# Altium schematic sheet Salmon.SchDoc: Top Sheet
size A3; SheetNumber: 1; SheetTotal: 6; DocumentName: Top Sheet
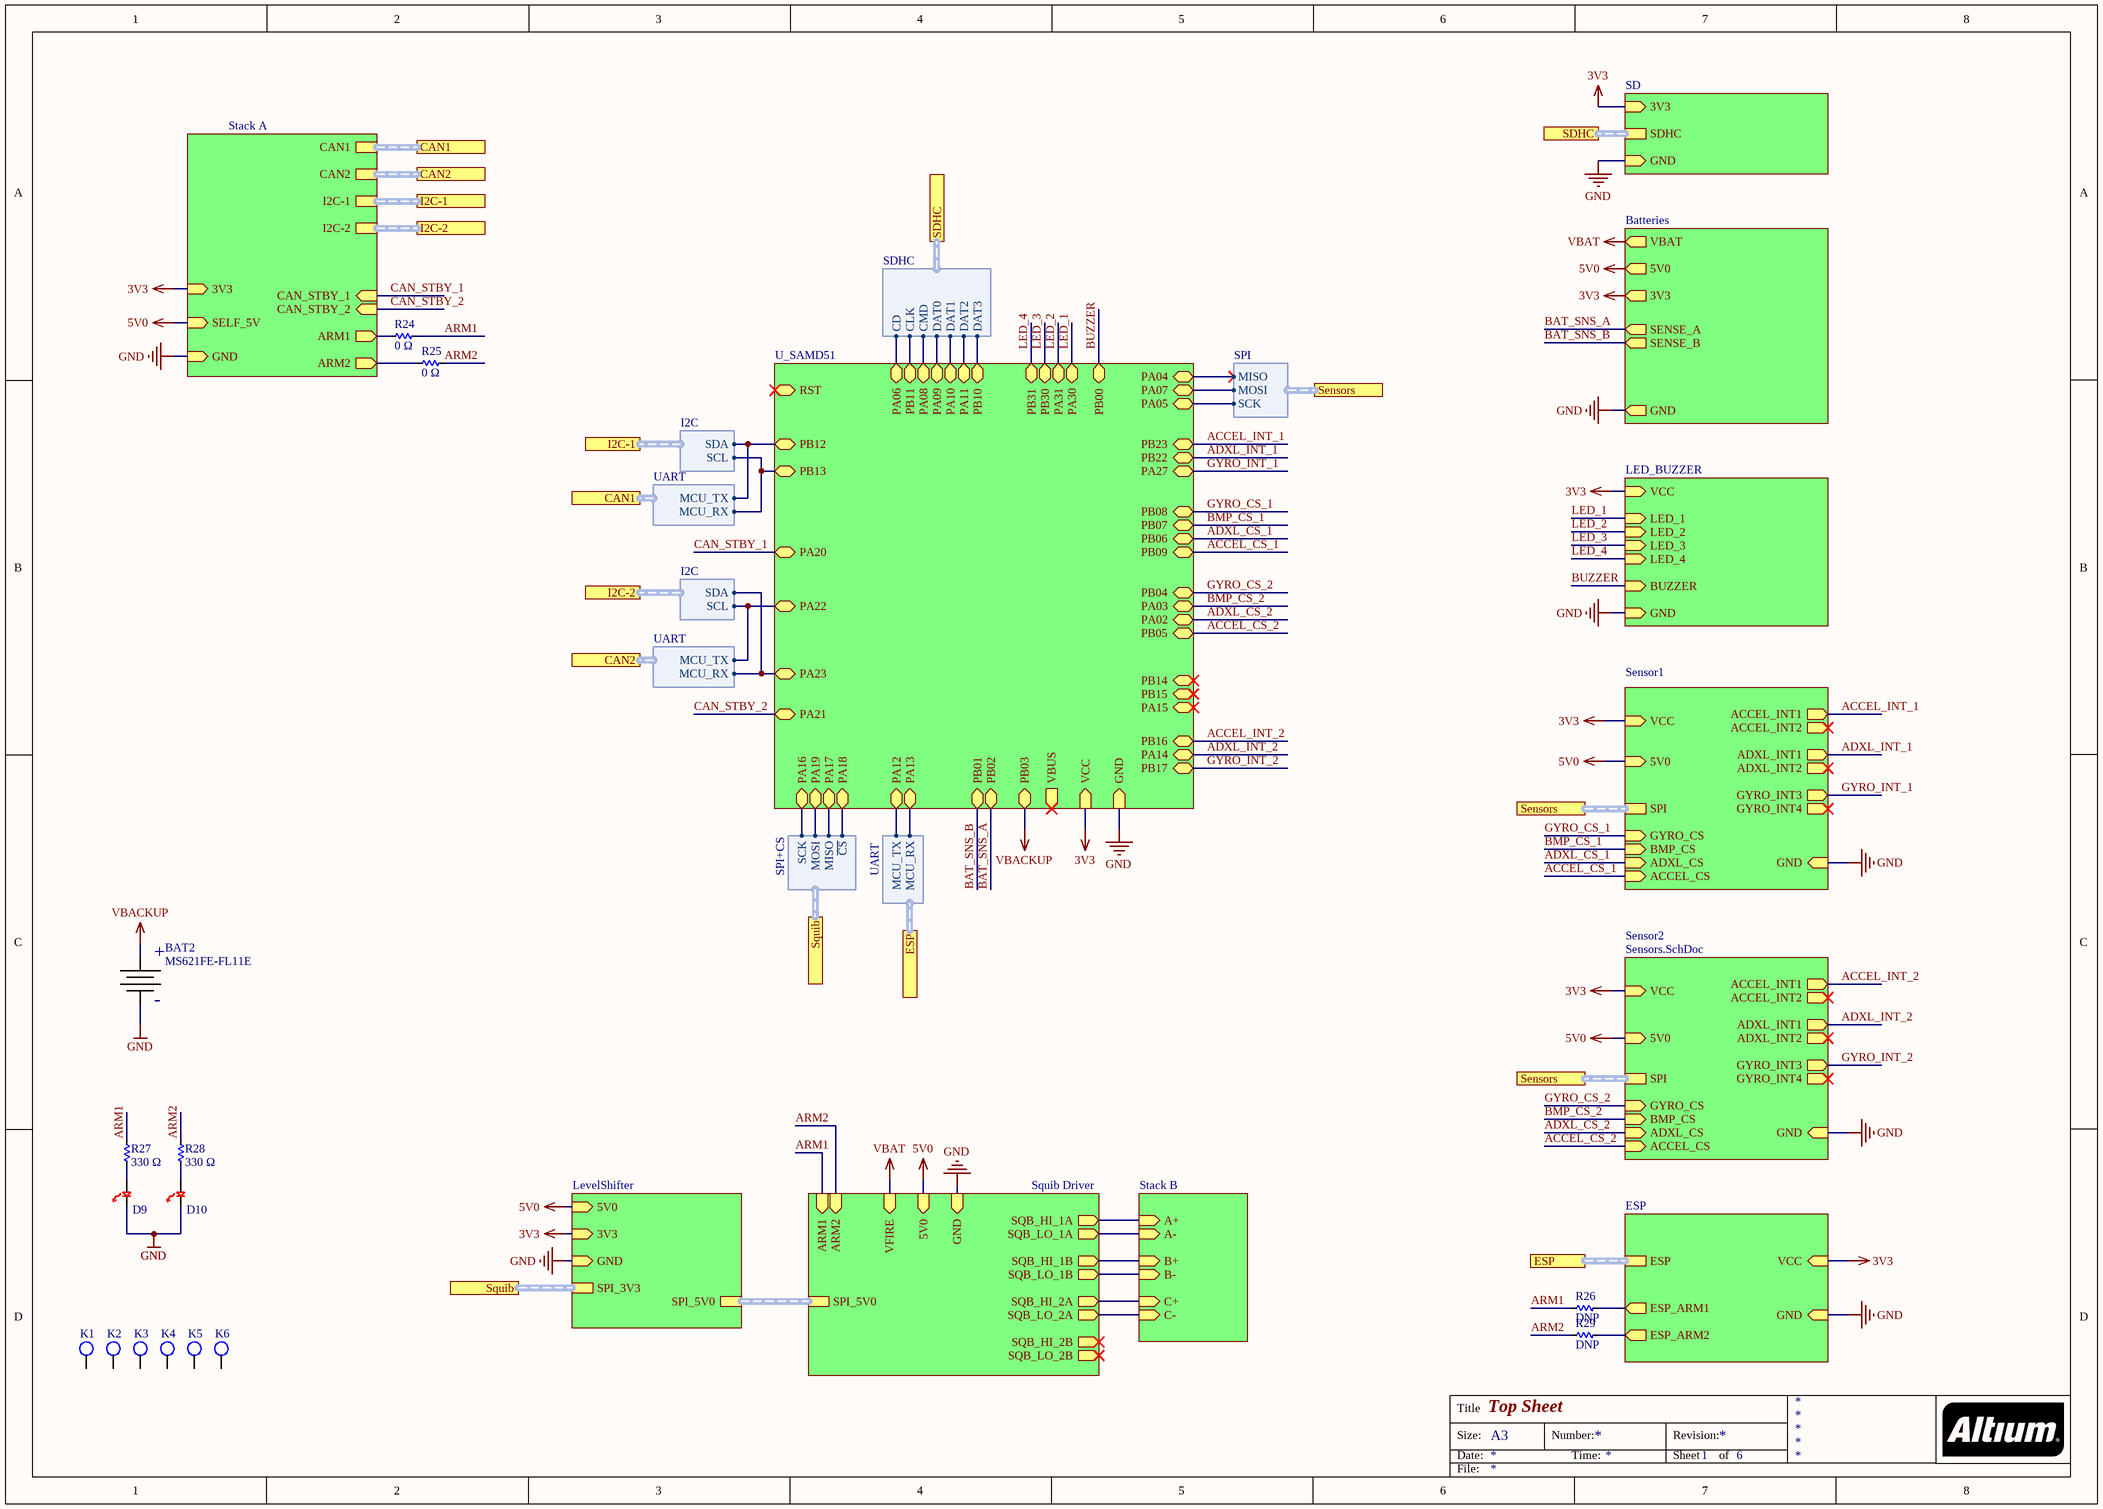
[diagram p0: Salmon.SchDoc]

## Parts
BAT2  MS621FE-FL11E  [BATT_COINCELL_RECHARGEABLE]
D9  RED  [0805_Diode]  (value not drawn)
D10  RED  [0805_Diode]  (value not drawn)
K1  92985A610  [#4_PRESSFIT_FOOT_1/4]  (value not drawn)
K2  92985A610  [#4_PRESSFIT_FOOT_1/4]  (value not drawn)
K3  92985A610  [#4_PRESSFIT_FOOT_1/4]  (value not drawn)
K4  92985A610  [#4_PRESSFIT_FOOT_1/4]  (value not drawn)
K5  92985A610  [#4_PRESSFIT_FOOT_1/4]  (value not drawn)
K6  92985A610  [#4_PRESSFIT_FOOT_1/4]  (value not drawn)
R24  Resistance: 0 Ω  [R0603]  (hidden comment: __template_resistor)
R25  Resistance: 0 Ω  [R0603]  (hidden comment: __template_resistor)
R26  Resistance: DNP  [R0603]  (hidden comment: __template_resistor)
R27  Resistance: 330 Ω  [R0603]  (hidden comment: __template_resistor)
R28  Resistance: 330 Ω  [R0603]  (hidden comment: __template_resistor)
R29  Resistance: DNP  [R0603]  (hidden comment: __template_resistor)

## Sub-sheets
Batteries = Battery_Management: SENSE_A (out), SENSE_B (out), 5V0 (out), GND (out), 3V3 (out), VBAT (out)
ESP = ESP8266.SchDoc: ESP_ARM2 (out), ESP_ARM1 (out), VCC (in), GND (in), ESP (harness UART)
LED_BUZZER = Blink_Blink_Beep_Boop: LED_1 (in), LED_2 (in), LED_3 (in), LED_4 (in), BUZZER (in), GND (in), VCC (in)
LevelShifter = LevelShifter.SchDoc: SPI_3V3 (harness SPI+CS), SPI_5V0 (harness SPI+CS), 5V0 (in), 3V3 (in), GND (in)
SD = SD.SchDoc: SDHC (harness SDHC), GND (in), 3V3 (in)
Sensor1 = Sensors.SchDoc: SPI (harness SPI), GYRO_CS (in), BMP_CS (in), ADXL_CS (in), ACCEL_CS (in), ACCEL_INT1 (out), ACCEL_INT2 (out), ADXL_INT1 (out), ADXL_INT2 (out), GYRO_INT3 (out), GYRO_INT4 (out), GND (in), VCC (in), 5V0 (in)
Sensor2 = Sensors.SchDoc: SPI (harness SPI), GYRO_CS (in), BMP_CS (in), ADXL_CS (in), ACCEL_CS (in), ACCEL_INT1 (out), ACCEL_INT2 (out), ADXL_INT1 (out), ADXL_INT2 (out), GYRO_INT3 (out), GYRO_INT4 (out), GND (in), VCC (in), 5V0 (in)
Squib Driver = MC33797.SchDoc: SPI_5V0 (harness SPI+CS), SQB_LO_1A (out), SQB_HI_1A (out), SQB_LO_1B (out), SQB_HI_1B (out), SQB_HI_2A (out), SQB_LO_2A (out), ARM1 (in), ARM2 (in), 5V0 (in), VFIRE (in), GND (in), SQB_HI_2B (out), SQB_LO_2B (out)
Stack A = Stack_A.SchDoc: CAN2 (harness UART), I2C-2 (harness I2C), I2C-1 (harness I2C), CAN1 (harness UART), CAN_STBY_2 (in), CAN_STBY_1 (in), ARM1 (out), ARM2 (out), GND (in), SELF_5V (in), 3V3 (in)
Stack B = Stack_B.SchDoc: B- (in), C+ (in), B+ (in), A- (in), A+ (in), C- (in)
U_SAMD51 = SAMD51.SchDoc: PA12 (bidir), PA13 (bidir), PA05 (bidir), PA07 (bidir), PA04 (bidir), PA06 (bidir), PB11 (bidir), PA08 (bidir), PA09 (bidir), PA10 (bidir), PA11 (bidir), PB10 (bidir), PB12 (bidir), PB13 (bidir), PA22 (bidir), PA23 (bidir), PA16 (bidir), PA19 (bidir), PA17 (bidir), PA20 (bidir), PA21 (bidir), PB08 (bidir), PB07 (bidir), PB06 (bidir), PB09 (bidir), PB04 (bidir), PA03 (bidir), PA02 (bidir), PB05 (bidir), PB00 (bidir), PB30 (bidir), PA31 (bidir), PA30 (bidir), PB31 (bidir), PB16 (bidir), PA14 (bidir), PB17 (bidir), PB23 (bidir), PB22 (bidir), PA27 (bidir), PB02 (bidir), PB01 (bidir), PB03 (bidir), PA18 (bidir), GND (in), VCC (in), VBUS (out), PB14 (bidir), PB15 (bidir), PA15 (bidir), RST (bidir)

## Ports
CAN1 (harness UART), CAN2 (harness UART), ESP (harness UART), I2C-1 (harness I2C), I2C-2 (harness I2C), SDHC, SDHC (harness SDHC), Sensors (harness SPI), Squib (harness SPI+CS)

## Harnesses
UART: MCU_TX, MCU_RX
SPI: MISO, MOSI, SCK
SDHC: CD, CLK, CMD, DAT0, DAT1, DAT2, DAT3
I2C: SCL, SDA
UART: MCU_RX, MCU_TX
SPI+CS: MISO, MOSI, SCK, ~{CS}

## Nets
3V3: sheet Sensor1/VCC, sheet Batteries/3V3, sheet LED_BUZZER/VCC, sheet ESP/VCC, sheet U_SAMD51/VCC, sheet Sensor2/VCC, sheet Stack A/3V3, sheet LevelShifter/3V3, sheet SD/3V3
5V0: sheet Sensor1/5V0, sheet Batteries/5V0, sheet Sensor2/5V0, sheet Stack A/SELF_5V, sheet Squib Driver/5V0, sheet LevelShifter/5V0
GND: BAT2.- D9.1 D10.1 ; sheet Sensor1/GND, sheet Batteries/GND, sheet LED_BUZZER/GND, sheet ESP/GND, sheet U_SAMD51/GND, sheet Sensor2/GND, sheet Stack A/GND, sheet Squib Driver/GND, sheet LevelShifter/GND, sheet SD/GND
VBACKUP: BAT2.+ ; sheet U_SAMD51/PB03
VBAT: sheet Batteries/VBAT, sheet Squib Driver/VFIRE
ACCEL_CS_1: sheet Sensor1/ACCEL_CS, sheet U_SAMD51/PB09
ACCEL_CS_2: sheet U_SAMD51/PB05, sheet Sensor2/ACCEL_CS
ACCEL_INT_1: sheet Sensor1/ACCEL_INT1, sheet U_SAMD51/PB23
ACCEL_INT_2: sheet U_SAMD51/PB16, sheet Sensor2/ACCEL_INT1
ADXL_CS_1: sheet Sensor1/ADXL_CS, sheet U_SAMD51/PB06
ADXL_CS_2: sheet U_SAMD51/PA02, sheet Sensor2/ADXL_CS
ADXL_INT_1: sheet Sensor1/ADXL_INT1, sheet U_SAMD51/PB22
ADXL_INT_2: sheet U_SAMD51/PA14, sheet Sensor2/ADXL_INT1
ARM1: R24.2 R26.1 R27.2 ; sheet Squib Driver/ARM1
ARM2: R25.2 R28.2 R29.1 ; sheet Squib Driver/ARM2
BAT_SNS_A: sheet Batteries/SENSE_A, sheet U_SAMD51/PB02
BAT_SNS_B: sheet Batteries/SENSE_B, sheet U_SAMD51/PB01
BMP_CS_1: sheet Sensor1/BMP_CS, sheet U_SAMD51/PB07
BMP_CS_2: sheet U_SAMD51/PA03, sheet Sensor2/BMP_CS
BUZZER: sheet LED_BUZZER/BUZZER, sheet U_SAMD51/PB00
CAN_STBY_1: sheet U_SAMD51/PA20, sheet Stack A/CAN_STBY_1
CAN_STBY_2: sheet U_SAMD51/PA21, sheet Stack A/CAN_STBY_2
GYRO_CS_1: sheet Sensor1/GYRO_CS, sheet U_SAMD51/PB08
GYRO_CS_2: sheet U_SAMD51/PB04, sheet Sensor2/GYRO_CS
GYRO_INT_1: sheet Sensor1/GYRO_INT3, sheet U_SAMD51/PA27
GYRO_INT_2: sheet U_SAMD51/PB17, sheet Sensor2/GYRO_INT3
LED_1: sheet LED_BUZZER/LED_1, sheet U_SAMD51/PA30
LED_2: sheet LED_BUZZER/LED_2, sheet U_SAMD51/PA31
LED_3: sheet LED_BUZZER/LED_3, sheet U_SAMD51/PB30
LED_4: sheet LED_BUZZER/LED_4, sheet U_SAMD51/PB31
NetD9_2: D9.2 R27.1
NetD10_2: D10.2 R28.1
NetR24_1: R24.1 ; sheet Stack A/ARM1
NetR25_1: R25.1 ; sheet Stack A/ARM2
NetR26_2: R26.2 ; sheet ESP/ESP_ARM1
NetR29_2: R29.2 ; sheet ESP/ESP_ARM2
(unnamed): sheet U_SAMD51/PA12, port ESP.MCU_TX
(unnamed): sheet U_SAMD51/PA13, port ESP.MCU_RX
(unnamed): sheet U_SAMD51/PA05, port Sensors.SCK
(unnamed): sheet U_SAMD51/PA07, port Sensors.MOSI
(unnamed): sheet U_SAMD51/PA04, port Sensors.MISO
(unnamed): sheet U_SAMD51/PA06, port SDHC.CD
(unnamed): sheet U_SAMD51/PB11, port SDHC.CLK
(unnamed): sheet U_SAMD51/PA08, port SDHC.CMD
(unnamed): sheet U_SAMD51/PA09, port SDHC.DAT0
(unnamed): sheet U_SAMD51/PA10, port SDHC.DAT1
(unnamed): sheet U_SAMD51/PA11, port SDHC.DAT2
(unnamed): sheet U_SAMD51/PB10, port SDHC.DAT3
(unnamed): sheet U_SAMD51/PB12, port I2C-1.SDA, port CAN1.MCU_TX
(unnamed): sheet U_SAMD51/PB13, port I2C-1.SCL, port CAN1.MCU_RX
(unnamed): sheet U_SAMD51/PA22, port I2C-2.SCL, port CAN2.MCU_TX
(unnamed): sheet U_SAMD51/PA23, port I2C-2.SDA, port CAN2.MCU_RX
(unnamed): sheet U_SAMD51/PA16, port Squib.SCK
(unnamed): sheet U_SAMD51/PA19, port Squib.MOSI
(unnamed): sheet U_SAMD51/PA17, port Squib.MISO
(unnamed): sheet U_SAMD51/PA18, port Squib.~{CS}
(unnamed): sheet Stack B/B-, sheet Squib Driver/SQB_LO_1B
(unnamed): sheet Stack B/C+, sheet Squib Driver/SQB_HI_2A
(unnamed): sheet Stack B/B+, sheet Squib Driver/SQB_HI_1B
(unnamed): sheet Stack B/A-, sheet Squib Driver/SQB_LO_1A
(unnamed): sheet Stack B/A+, sheet Squib Driver/SQB_HI_1A
(unnamed): sheet Stack B/C-, sheet Squib Driver/SQB_LO_2A

Not connected (* = marked no-connect by the designer): K1 1; K2 1; K3 1; K4 1; K5 1; K6 1

## Buses and harness runs
harness port CAN1 = sheet Stack A/CAN1
harness port CAN2 = sheet Stack A/CAN2
harness port ESP = sheet ESP/ESP
harness port I2C-1 = sheet Stack A/I2C-1
harness port I2C-2 = sheet Stack A/I2C-2
harness port SDHC = sheet SD/SDHC
harness port Sensors = sheet Sensor1/SPI
harness port Sensors = sheet Sensor2/SPI
harness port Squib = sheet LevelShifter/SPI_3V3
harness sheet LevelShifter/SPI_5V0 = sheet Squib Driver/SPI_5V0

## Notes on the sheet
- Title
- Size:
- Date:
- A3
- Number:
- Time:
- Revision:
- Sheet
- of
- File:

## Library data of the parts
BAT2 = BAT_MS621FE: MS621FE RECHARGEABLE COIN CELL BACKUP; Manufacturer: Seiko Instruments; Battery Chemistry: Lithium; Battery Cell Size: Coin, 6.8mm; Capacity: 5.5mAh; Discharge Rate: 15µA; Shipping Info: Due to restrictions, only ground shipment is allowed.; Supplier 1: Digi-Key; Manufacturer Part Number: MS621FE-FL11E; RoHS: RoHS Compliant; Category: Battery Products; Stock 1: 41059; Pricing 1: 1=2.04, 10=1.838, 50=1.6338, 100=1.4296, 250=1.30704, 500=1.22534, 1000=1.09051, 2500=1.0112, 5000=0.99138 (USD); Part Status: Active; Size / Dimension: 0.27" Dia x 0.08" H (6.8mm x 2.1mm); Termination Style: SMD (SMT) Tab; Standard Charge Current: 15µA; Standard Charge Time: -; Weight: 0.23g; ComponentLink1URL: http://www.sii.co.jp/en/me/files/2017/04/MicroBatteryCatalogue-E_2017_web.pdf; ComponentLink1Description: http://www.sii.co.jp/en/me/files/2017/04/MicroBatteryCatalogue-E_2017_web.pdf; Supplier Part Number 1: 728-1057-ND
D9 D10 = LED_LY974: LED 0805 RED 20MA; Manufacturer: OSRAM Opto Semiconductors Inc; Manufacturer Part Number: LH R974-LP-1; Wavelength - Dominant: 645nm; Wavelength - Peak: 660nm; Millicandela Rating: 41mcd; Voltage - Forward (Vf) (Typ): 1.8V; Viewing Angle: 160°; Lens Transparency: Diffused; Lens Color: White; Lens Style/Size: Rectangle with Flat Top, 1.30mm x 1.25mm; Supplier 1: Digi-Key; RoHS: RoHS Compliant; Category: Optoelectronics; Stock 1: 66379; Pricing 1: 1=0.08, 10=0.07, 100=0.0559, 250=0.04892, 500=0.04472 (USD); Packaging: Cut Tape (CT); Color: Red; Package / Case: 0805 (2012 Metric); Supplier Device Package: *; Size / Dimension: 2.00mm L x 1.25mm W; Height (Max): 0.80mm; Mounting Type: Surface Mount; ComponentLink1URL: http://www.osram-os.com/Graphics/XPic8/00078869_0.pdf; ComponentLink1Description: http://www.osram-os.com/Graphics/XPic8/00078869_0.pdf; Supplier Part Number 1: 475-1415-1-ND; Current - Test: 20mA
K1-K6 = #4_PRESSFIT_MOUNTING_FOOT: Press-Fit Unthreaded Spacers, 7/32" OD, 1/8" Long; Supplier Link: https://www.mcmaster.com/#92985a610/=16cb2ec
R24 R25 = RES SMD 0 OHM JUMPER 1/10W 0603: Manufacturer Part Number: RC0603FR-070RL; Manufacturer: Yageo; Resistance (Sortable): 0; Tolerance: Jumper; Power (Watts): 0.1W, 1/10W; Supplier 1: Digikey; Datasheets: http://www.yageo.com/documents/recent/PYu-RC_Group_51_RoHS_L_9.pdf; Image: //media.digikey.com/Renders/Yageo%20Renders/0603-(1608-Metric).jpg; Supplier Part Number 1: 311-0.0HRCT-ND; Temperature Coefficient: -; Operating Temperature: -55°C ~ 155°C
R26 R29 = RES SMD DNP 0603: Resistance (Sortable): DNP
R27 R28 = RES SMD 330 OHM 1% 1/10W 0603: Manufacturer Part Number: RC0603FR-07330RL; Manufacturer: Yageo; Resistance (Sortable): 330; Tolerance: ±1%; Power (Watts): 0.1W, 1/10W; Temperature Coefficient: ±100ppm/°C; Supplier 1: Digikey; Datasheets: http://www.yageo.com/documents/recent/PYu-RC_Group_51_RoHS_L_9.pdf; Image: //media.digikey.com/Renders/Yageo%20Renders/0603-(1608-Metric).jpg; Supplier Part Number 1: 311-330HRCT-ND; Operating Temperature: -55°C ~ 155°C